# Altium schematic sheet SCH_01_Power.SchDoc
size A4; SheetNumber: 6; SheetTotal: 14; SPICEModelCacheESGLKFNC: <root> / <DocumentId>ESGLKFNC</DocumentId> / </root>
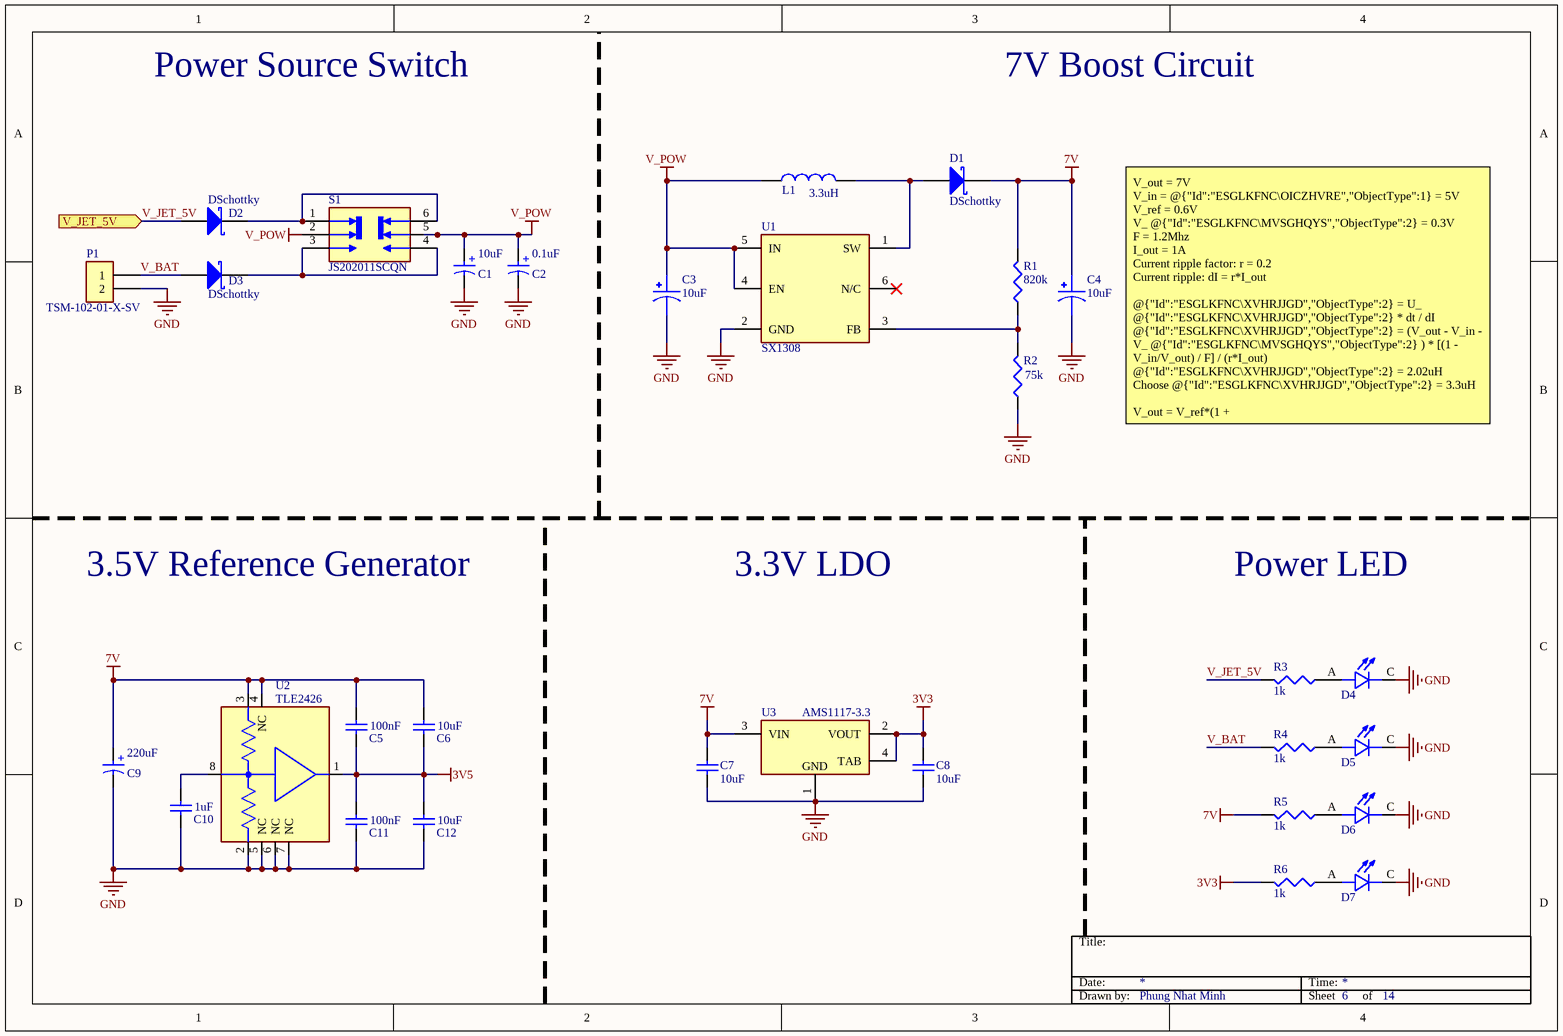
[diagram p0: SCH_01_Power.SchDoc]

## Parts
C1  10uF  [WCAP-ASLI_D4H5.5]
C2  0.1uF  [WCAP-ASLI_D4H5.5]
C3  10uF  [CAPPM6032X280N]
C4  10uF  [CAPPM6032X280N]
C5  100nF  [WCAP-CSGP_0603_L1.6W0.8H0.8_Reflow]
C6  10uF  [WCAP-CSGP_0603_L1.6W0.8H0.8_Reflow]
C7  10uF  [WCAP-CSGP_0603_L1.6W0.8H0.8_Reflow]
C8  10uF  [WCAP-CSGP_0603_L1.6W0.8H0.8_Reflow]
C9  220uF  [WCAP-ASLI_D6.3H7.7]
C10  1uF  [WCAP-CSGP_0603_L1.6W0.8H0.8_Reflow]
C11  100nF  [WCAP-CSGP_0603_L1.6W0.8H0.8_Reflow]
C12  10uF  [WCAP-CSGP_0603_L1.6W0.8H0.8_Reflow]
D1  DSchottky  [PCBComponent_1]
D2  DSchottky  [PCBComponent_1]
D3  DSchottky  [PCBComponent_1]
D4  SML-LXT0805IW-TR  [LEDC2012X120N]  (value not drawn)
D5  SML-LXT0805IW-TR  [LEDC2012X120N]  (value not drawn)
D6  SML-LXT0805IW-TR  [LEDC2012X120N]  (value not drawn)
D7  SML-LXT0805IW-TR  [LEDC2012X120N]  (value not drawn)
L1  3.3uH  [WE-PD2A_4532]
P1  TSM-102-01-X-SV  [SAMTEC_TSM-102-01-X-SV]
R1  820k  [WRIS-PSMB_0603_L1.6W0.8H0.35]
R2  75k  [WRIS-PSMB_0603_L1.6W0.8H0.35]
R3  1k  [WRIS-PSMB_0603_L1.6W0.8H0.35]
R4  1k  [WRIS-PSMB_0603_L1.6W0.8H0.35]
R5  1k  [WRIS-PSMB_0603_L1.6W0.8H0.35]
R6  1k  [WRIS-PSMB_0603_L1.6W0.8H0.35]
S1  JS202011SCQN  [SW_JS202011SCQN]
U1  SX1308  [SOT-23-6]
U2  TLE2426  [SO8]
U3  AMS1117-3.3  [SOT229P700X180-4N]

## Ports
V_JET_5V (in, see Schematic_Top[1C], SCH_09_InOut_Terminal[2C])

## Nets
3V3: C8.2 R6.2 U3.2(VOUT) U3.4(TAB)
3V5: C5.1 C6.1 C11.2 C12.2 U2.1(OUT)
7V: C4.1 C5.2 C6.2 C7.2 C9.1(P) D1.2(K) R1.2 R5.2 U2.3(V+) U2.4(NC) U3.3(VIN)
GND: C1.2(N) C2.2(N) C3.2 C4.2 C7.1 C8.1 C9.2(N) C10.1 C11.1 C12.1 D4.C D5.C D6.C D7.C P1.2 R2.1 U1.2(GND) U2.2(V-) U2.5(NC) U2.6(NC) U2.7(NC) U3.1(GND/ADJ)
V_POW: C1.1(P) C2.1(P) C3.1 L1.1 S1.2 S1.5 U1.4(EN) U1.5(IN)
V_BAT: D3.1(A) P1.1 R4.2
V_JET_5V: D2.1(A) R3.2 ; port V_JET_5V
NetC10_2: C10.2 U2.8(NR)
NetD1_1: D1.1(A) L1.2 U1.1(SW)
NetD2_2: D2.2(K) S1.1 S1.6
NetD3_2: D3.2(K) S1.3 S1.4
NetD4_A: D4.A R3.1
NetD5_A: D5.A R4.1
NetD6_A: D6.A R5.1
NetD7_A: D7.A R6.1
NetR1_1: R1.1 R2.2 U1.3(FB)

Not connected (* = marked no-connect by the designer): U1 6(N/C)*

## Notes on the sheet
- Power Source Switch
- 7V Boost Circuit
- V_out = 7V
  V_in = @{"Id":"ESGLKFNC\OICZHVRE","ObjectType":1} = 5V
  V_ref = 0.6V
  V_ @{"Id":"ESGLKFNC\MVSGHQYS","ObjectType":2} = 0.3V
  F = 1.2Mhz
  I_out = 1A
  Current ripple factor: r = 0.2
  Current ripple: dI = r*I_out
  @{"Id":"ESGLKFNC\XVHRJJGD","ObjectType":2} = U_ @{"Id":"ESGLKFNC\XVHRJJGD","ObjectType":2} * dt / dI
  @{"Id":"ESGLKFNC\XVHRJJGD","ObjectType":2} = (V_out - V_in - V_ @{"Id":"ESGLKFNC\MVSGHQYS","ObjectType":2} ) * [(1 - V_in/V_out) / F] / (r*I_out)
  @{"Id":"ESGLKFNC\XVHRJJGD","ObjectType":2} = 2.02uH
  Choose @{"Id":"ESGLKFNC\XVHRJJGD","ObjectType":2} = 3.3uH
  V_out = V_ref*(1 + @{"Id":"ESGLKFNC\TLFOOIWW","ObjectType":2} / @{"Id":"ESGLKFNC\CCQALEBM","ObjectType":2} )
  @{"Id":"ESGLKFNC\TLFOOIWW","ObjectType":2} + @{"Id":"ESGLKFNC\CCQALEBM","ObjectType":2} ≈ 1M
  Choose @{"Id":"ESGLKFNC\TLFOOIWW","ObjectType":2} = 820k, @{"Id":"ESGLKFNC\CCQALEBM","ObjectType":2} = 75k.
- 3.5V Reference Generator
- 3.3V LDO
- Power LED
- Title:
- Date:
- Time:
- Drawn by:
- Phung Nhat Minh
- Sheet
- of
- (in symbol 865080245009) +
- (in symbol 865080440002) +
- (in symbol 865080740002) +
- (in symbol AMS1117-5.0) GND

## Library data of the parts
C1 = 865080440002: WCAP-ASLI Aluminum Electrolytic Capacitor, V-Chip, D4 x H5.5mm, 10uF, 25V; Manufacturer: Wurth Elektronik; Capacitance Tolerance: +/-20%; Dissipation Factor: 14%; Endurance: 2000h; Leakage Current: 3uA; Ripple Current: 85mA; Technical Reference: ASEB055100M025DVCTAB000; Manufacturer Part Number: 865080440002; Category: Aluminum Electrolytic Capacitors; Match Code: WCAP-ASLI; ComponentLink1Description: Website Link; ComponentLink1URL: https://www.we-online.com/redexpert/article/865080440002?ad; ComponentLink2Description: Datasheet Link; ComponentLink2URL: https://www.we-online.com/redexpert/spec/865080440002?ad; Mount: Surface Mount; Operating Temperature Max: 105°C; Operating Temperature Min: -55°C; Packaging: Tape and Reel; Height: 5.5mm; Diameter: 4mm; Capacitance: 10uF; Rated Voltage (DC): 25V
C2 = 865080740002: WCAP-ASLI Aluminum Electrolytic Capacitor, V-Chip, D4 x H5.5mm, 0.1uF, 63V; Manufacturer: Wurth Elektronik; Capacitance Tolerance: +/-20%; Dissipation Factor: 12%; Endurance: 2000h; Leakage Current: 3uA; Ripple Current: 1mA; Technical Reference: ASEB055R10M063DVCTAB000; Manufacturer Part Number: 865080740002; Category: Aluminum Electrolytic Capacitors; Match Code: WCAP-ASLI; ComponentLink1Description: Website Link; ComponentLink1URL: https://www.we-online.com/redexpert/article/865080740002?ad; ComponentLink2Description: Datasheet Link; ComponentLink2URL: https://www.we-online.com/redexpert/spec/865080740002?ad; Mount: Surface Mount; Operating Temperature Max: 105°C; Operating Temperature Min: -55°C; Packaging: Tape and Reel; Height: 5.5mm; Diameter: 4mm; Capacitance: 0.1uF; Rated Voltage (DC): 63V
C3 C4 = TAJC106K016RNJ: 10µF Molded Tantalum Capacitors 16V 2312 (6032 Metric) 2Ohm; MF: AVX Interconnect / Elco; Value: *; MP: TAJC106K016RNJ; Package: 2312 AVX Interconnect / Elco; SnapEDA_Link: https://www.snapeda.com/parts/TAJC106K016RNJ/AVX%20Interconnect%20/%20Elco/view-part/4773/?ref=snap; Price: None; Availability: Unavailable; Check_prices: https://www.snapeda.com/parts/TAJC106K016RNJ/AVX%20Interconnect%20/%20Elco/view-part/4773/?ref=eda
C5 C11 = 885012206095: WCAP-CSGP Multilayer Ceramic Chip Capacitor, General Purpose, size 0603, X7R, 100nF, 50VDC; Manufacturer: Wurth Elektronik; Case/Size Code: 0603; Capacitance Tolerance: +/-10%; Dissipation Factor: 3%; Insulation Resistance: 5GOhm; Rated Voltage (DC): 50V; Technical Reference: X7R0603104K050DFCT10000; Manufacturer Part Number: 885012206095; Category: Multilayer Ceramic Chip Capacitors; Match Code: WCAP-CSGP; ComponentLink1Description: Website Link; ComponentLink1URL: https://www.we-online.com/redexpert/article/885012206095?ad; ComponentLink2Description: Datasheet Link; ComponentLink2URL: https://www.we-online.com/redexpert/spec/885012206095?ad; Mount: Surface Mount; Operating Temperature Max: 125°C; Operating Temperature Min: -55°C; Packaging: Tape and Reel; Length: 1.6mm; Width: 0.8mm; Height: 0.8mm; Capacitance: 100nF; Ceramic Type: X7R
C6-C8 C12 = 885012106031: WCAP-CSGP Multilayer Ceramic Chip Capacitor, General Purpose, size 0603, X5R, 10uF, 25VDC; Manufacturer: Wurth Elektronik; Case/Size Code: 0603; Capacitance Tolerance: +/20%; Dissipation Factor: 20%; Insulation Resistance: 0.01GOhm; Rated Voltage (DC): 25V; Technical Reference: X5R0603106M025DFCT10000; Manufacturer Part Number: 885012106031; Category: Multilayer Ceramic Chip Capacitors; Match Code: WCAP-CSGP; ComponentLink1Description: Website Link; ComponentLink1URL: https://www.we-online.com/redexpert/article/885012106031?ad; ComponentLink2Description: Datasheet Link; ComponentLink2URL: https://www.we-online.com/redexpert/spec/885012106031?ad; Mount: Surface Mount; Operating Temperature Max: 85°C; Operating Temperature Min: -55°C; Packaging: Tape and Reel; Length: 1.6mm; Width: 0.8mm; Height: 0.8mm; Capacitance: 10uF; Ceramic Type: X5R
C9 = 865080245009: WCAP-ASLI Aluminum Electrolytic Capacitor, V-Chip, D6.3 x H7.7mm, 220uF, 10V; Manufacturer: Wurth Elektronik; Capacitance Tolerance: +/-20%; Dissipation Factor: 19%; Endurance: 2000h; Leakage Current: 22uA; Ripple Current: 270mA; Technical Reference: ASED077221M010DVCTCB000; Manufacturer Part Number: 865080245009; Category: Aluminum Electrolytic Capacitors; Match Code: WCAP-ASLI; ComponentLink1Description: Website Link; ComponentLink1URL: https://www.we-online.com/redexpert/article/865080245009?ad; ComponentLink2Description: Datasheet Link; ComponentLink2URL: https://www.we-online.com/redexpert/spec/865080245009?ad; Mount: Surface Mount; Operating Temperature Max: 105°C; Operating Temperature Min: -55°C; Packaging: Tape and Reel; Height: 7.7mm; Diameter: 6.3mm; Capacitance: 220uF; Rated Voltage (DC): 10V
C10 = 885012206126: WCAP-CSGP Multilayer Ceramic Chip Capacitor, General Purpose, size 0603, X7R, 1uF, 50VDC; Manufacturer: Wurth Elektronik; Case/Size Code: 0603; Capacitance Tolerance: +/-10%; Dissipation Factor: 10%; Insulation Resistance: 0.5GOhm; Rated Voltage (DC): 50V; Technical Reference: X7R0603105K050DFCT10000; Manufacturer Part Number: 885012206126; Category: Multilayer Ceramic Chip Capacitors; Match Code: WCAP-CSGP; ComponentLink1Description: Website Link; ComponentLink1URL: https://www.we-online.com/redexpert/article/885012206126?ad; ComponentLink2Description: Datasheet Link; ComponentLink2URL: https://www.we-online.com/redexpert/spec/885012206126?ad; Mount: Surface Mount; Operating Temperature Max: 125°C; Operating Temperature Min: -55°C; Packaging: Tape and Reel; Length: 1.6mm; Width: 0.8mm; Height: 0.8mm; Capacitance: 1uF; Ceramic Type: X7R
D4-D7 = SML-LXT0805IW-TR: LED;Red;11mcd;0.061In.Dia.;SMD;100mA;2V Vf;635nm;140deg;SMD;White Diffused;5V Vr | Lumex SML-LXT0805IW-TR; MF: Lumex Opto/Components; SnapEDA_Link: https://www.snapeda.com/parts/SML-LXT0805IW-TR/Lumex+Opto%252FComponents+Inc./view-part/?ref=snap; Package: 0805 Lumex; Value: *; MP: SML-LXT0805IW-TR; Check_prices: https://www.snapeda.com/parts/SML-LXT0805IW-TR/Lumex+Opto%252FComponents+Inc./view-part/?ref=eda
L1 = 784773147: WE-PD2A SMT Power Inductor, size 4532, 3.3µH, 2A, 3.3Ω; Manufacturer: Wurth Elektronik; Case/Size Code: 4532; DC Resistance: 0.523Ω; DC Resistance Max: 0.844Ω; Inductance: 47µH; Rated Current: 0.68A; Rated Voltage: 80VDC; Saturation Current: 0.77A; Self Resonant Frequency: 12MHz; Manufacturer Part Number: 784773147; Category: Single Coil Power Inductors; Match Code: WE-PD2A; ComponentLink1Description: Website Link; ComponentLink1URL: https://www.we-online.com/redexpert/article/784773147?ad; ComponentLink2Description: Datasheet Link; ComponentLink2URL: https://www.we-online.com/redexpert/spec/784773147?ad; Mount: Surface Mount; Operating Temperature Max: 125°C; Operating Temperature Min: -40°C; Packaging: Tape and Reel; Length: 4.5mm; Width: 4mm; Height: 3.2mm; Automotive: Yes
P1 = TSM-102-01-X-SV: TSM - Samtec 2.54mm Single Row Vertical Surface Mount Header 5.84mm Post Height (01) - Fast Stock; MP: TSM-102-01-L-SV; SnapEDA_Link: https://www.snapeda.com/parts/TSM-102-01-L-SV/Samtec+Inc./view-part/?ref=snap; Package: None; Value: *; MF: Samtec; Check_prices: https://www.snapeda.com/parts/TSM-102-01-L-SV/Samtec+Inc./view-part/?ref=eda
R1-R6 = 580060716001: WRIS-PSMB Metal Plate Resistor, SMT, size 0603, 0.33W, 5mΩ, +/-1%; Manufacturer: Wurth Elektronik; Case/Size Code: 0603; Rated Current: 8.12A; Technical Reference: MB0603R005F103KAATP0000; Temperature Coefficient of Resistance: +/-100ppm/°C; Manufacturer Part Number: 580060716001; Category: Metal Plate Resistors; Match Code: WRIS-PSMB; ComponentLink1Description: Website Link; ComponentLink1URL: https://www.we-online.com/redexpert/article/580060716001?ad; ComponentLink2Description: Datasheet Link; ComponentLink2URL: https://www.we-online.com/redexpert/spec/580060716001?ad; Mount: Surface Mount; Operating Temperature Max: 155°C; Operating Temperature Min: -55°C; Packaging: Tape and Reel; Length: 1.6mm; Width: 0.8mm; Height: 0.35mm; Rated Power: 0.33W; Resistance: 5mΩ; Resistance Tolerance: +/-1%
U1 = SX1308: SX1308 - Transceiver; LoRaÂ® Evaluation Board; MF: Semtech Corporation; Price: None; Purchase-URL: https://pricing.snapeda.com/search/part/SX1308/?ref=eda; Check_prices: https://www.snapeda.com/parts/SX1308/Semtech+Corporation/view-part/?ref=eda; Value: *; SnapEDA_Link: https://www.snapeda.com/parts/SX1308/Semtech+Corporation/view-part/?ref=snap; Availability: In Stock; MP: SX1308; Package: - Semtech Corporation
U2 = TLE2426: Ground Reference (Virtual) Voltage Reference IC Adjustable 2V 20 VV Â±1% 20 mA 8-PDIP; MF: Texas Instruments; SnapEDA_Link: https://www.snapeda.com/parts/TLE2426/Texas+Instruments/view-part/?ref=snap; Package: None; Value: *; MP: TLE2426; Check_prices: https://www.snapeda.com/parts/TLE2426/Texas+Instruments/view-part/?ref=eda
U3 = AMS1117-5.0: 1A LOW DROPOUT VOLTAGE REGULATOR; MF: ams; MP: AMS1117-5.0; Package: SOT-223 Seeed Technology; SnapEDA_Link: https://www.snapeda.com/parts/AMS1117-5.0/ams/view-part/?ref=snap; Check_prices: https://www.snapeda.com/parts/AMS1117-5.0/ams/view-part/?ref=eda; Availability: Not in stock; Value: *; Price: None
S1 = JS202011SCQN: Price: None; MP: JS202011SCQN; Availability: Unavailable; Value: *; Package: None